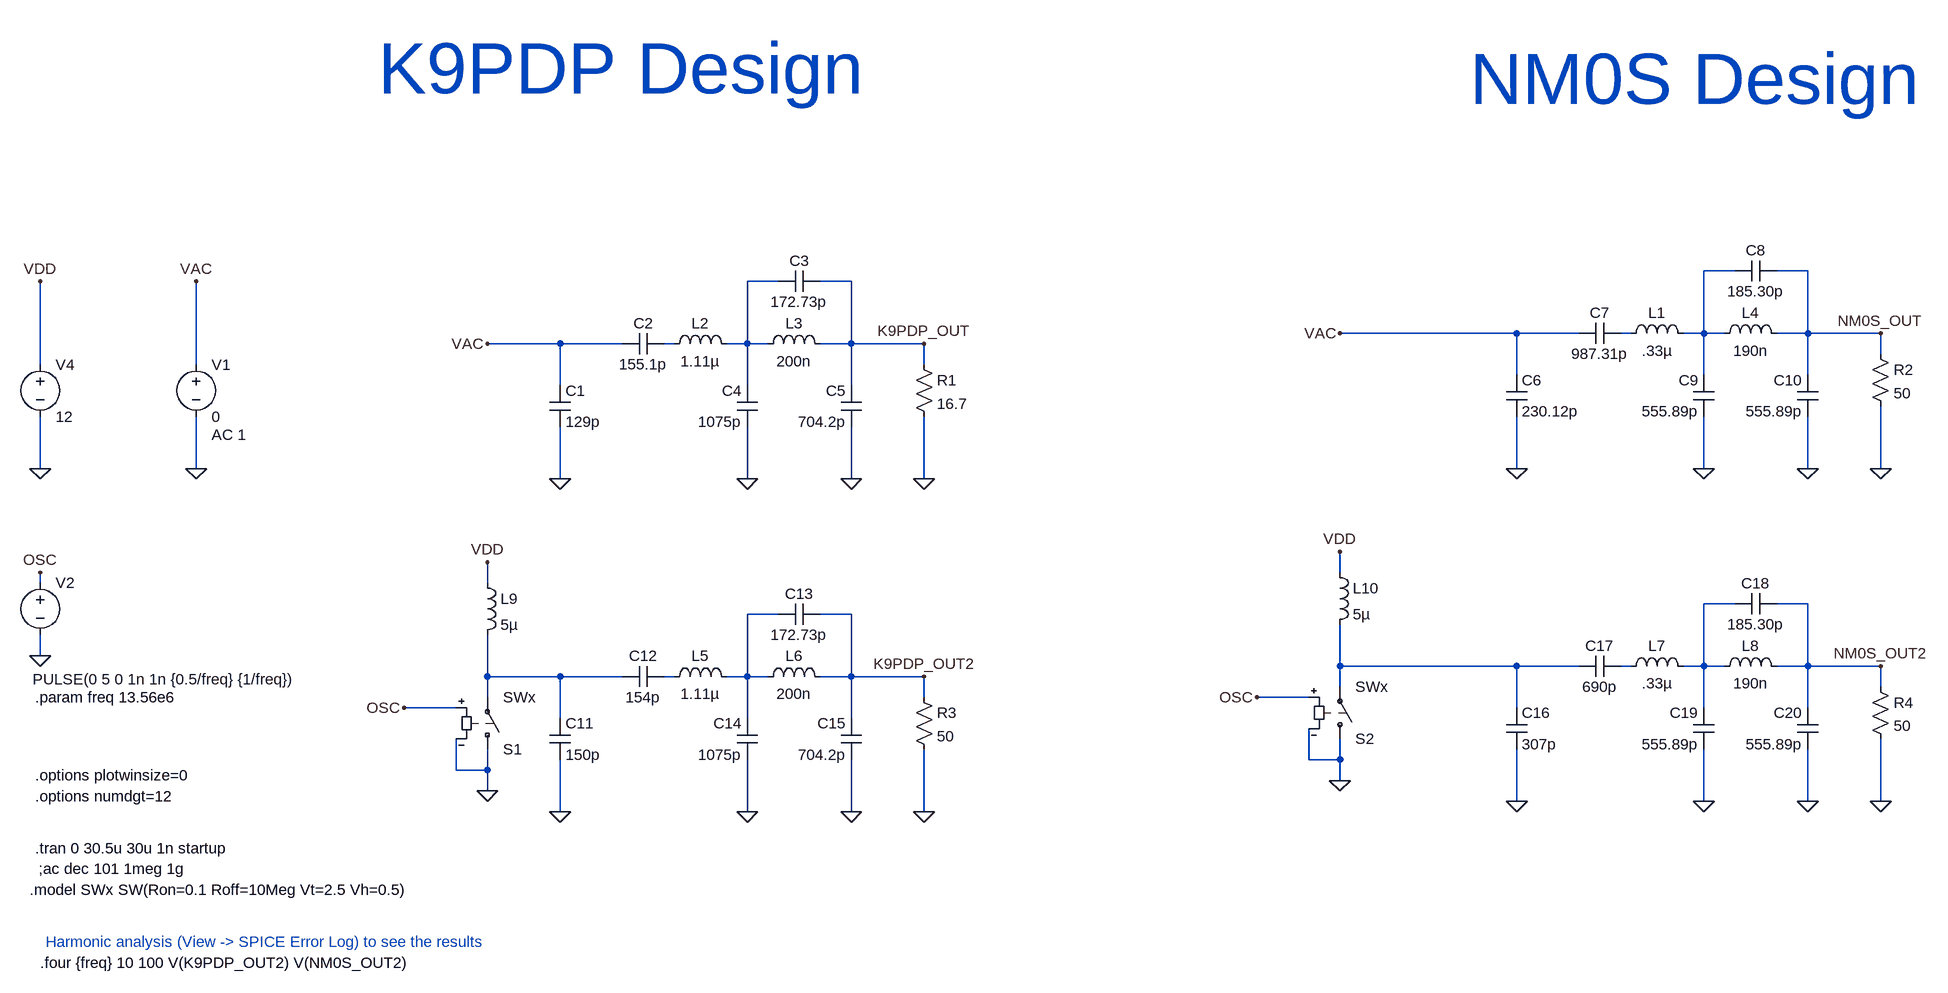
[diagram p0: schematic Class_E.asc]
Class_E.asc, the LTspice schematic file:
Version 4
SHEET 1 2136 1064
WIRE 1824 -16 1776 -16
WIRE 1936 -16 1888 -16
WIRE 352 0 304 0
WIRE 464 0 416 0
WIRE 1488 80 1216 80
WIRE 1584 80 1488 80
WIRE 1664 80 1648 80
WIRE 1776 80 1776 -16
WIRE 1776 80 1744 80
WIRE 1808 80 1776 80
WIRE 1936 80 1936 -16
WIRE 1936 80 1888 80
WIRE 2048 80 1936 80
WIRE 16 96 -96 96
WIRE 112 96 16 96
WIRE 192 96 176 96
WIRE 304 96 304 0
WIRE 304 96 272 96
WIRE 336 96 304 96
WIRE 464 96 464 0
WIRE 464 96 416 96
WIRE 576 96 464 96
WIRE 2048 112 2048 80
WIRE -784 128 -784 0
WIRE -544 128 -544 0
WIRE 576 128 576 96
WIRE 1488 144 1488 80
WIRE 1776 144 1776 80
WIRE 1936 144 1936 80
WIRE 16 160 16 96
WIRE 304 160 304 96
WIRE 464 160 464 96
WIRE -784 288 -784 208
WIRE -544 288 -544 208
WIRE 1488 288 1488 208
WIRE 1776 288 1776 208
WIRE 1936 288 1936 208
WIRE 2048 288 2048 192
WIRE 16 304 16 224
WIRE 304 304 304 224
WIRE 464 304 464 224
WIRE 576 304 576 208
WIRE 1216 448 1216 416
WIRE -784 464 -784 448
WIRE -96 464 -96 432
WIRE 1824 496 1776 496
WIRE 1936 496 1888 496
WIRE 352 512 304 512
WIRE 464 512 416 512
WIRE -784 576 -784 544
WIRE 1216 592 1216 528
WIRE 1488 592 1216 592
WIRE 1584 592 1488 592
WIRE 1664 592 1648 592
WIRE 1776 592 1776 496
WIRE 1776 592 1744 592
WIRE 1808 592 1776 592
WIRE 1936 592 1936 496
WIRE 1936 592 1888 592
WIRE 2048 592 1936 592
WIRE -96 608 -96 544
WIRE 16 608 -96 608
WIRE 112 608 16 608
WIRE 192 608 176 608
WIRE 304 608 304 512
WIRE 304 608 272 608
WIRE 336 608 304 608
WIRE 464 608 464 512
WIRE 464 608 416 608
WIRE 576 608 464 608
WIRE 1216 624 1216 592
WIRE 2048 624 2048 592
WIRE -96 640 -96 608
WIRE 576 640 576 608
WIRE 1168 640 1088 640
WIRE -144 656 -224 656
WIRE 1488 656 1488 592
WIRE 1776 656 1776 592
WIRE 1936 656 1936 592
WIRE 16 672 16 608
WIRE 304 672 304 608
WIRE 464 672 464 608
WIRE 1168 736 1168 688
WIRE 1216 736 1216 704
WIRE 1216 736 1168 736
WIRE -144 752 -144 704
WIRE -96 752 -96 720
WIRE -96 752 -144 752
WIRE 1216 768 1216 736
WIRE -96 784 -96 752
WIRE 1488 800 1488 720
WIRE 1776 800 1776 720
WIRE 1936 800 1936 720
WIRE 2048 800 2048 704
WIRE 16 816 16 736
WIRE 304 816 304 736
WIRE 464 816 464 736
WIRE 576 816 576 720
FLAG -544 288 0
FLAG 16 304 0
FLAG 304 304 0
FLAG 464 304 0
FLAG 576 304 0
FLAG 1488 288 0
FLAG 1776 288 0
FLAG 1936 288 0
FLAG 2048 288 0
FLAG 576 96 K9PDP_OUT
FLAG 2048 80 NM0S_OUT
FLAG -544 0 VAC
FLAG -96 96 VAC
FLAG 1216 80 VAC
FLAG 16 816 0
FLAG 304 816 0
FLAG 464 816 0
FLAG 576 816 0
FLAG 576 608 K9PDP_OUT2
FLAG 1488 800 0
FLAG 1776 800 0
FLAG 1936 800 0
FLAG 2048 800 0
FLAG 2048 592 NM0S_OUT2
FLAG -784 576 0
FLAG -96 784 0
FLAG 1216 768 0
FLAG -784 288 0
FLAG -784 0 VDD
FLAG -96 432 VDD
FLAG 1216 416 VDD
FLAG -784 448 OSC
FLAG -224 656 OSC
FLAG 1088 640 OSC
SYMBOL cap 0 160 R0
SYMATTR InstName C1
SYMATTR Value 129p
SYMBOL cap 176 80 R90
WINDOW 0 0 32 VBottom 2
WINDOW 3 32 32 VTop 2
SYMATTR InstName C2
SYMATTR Value 155.1p
SYMBOL cap 416 -16 R90
WINDOW 0 0 32 VBottom 2
WINDOW 3 32 32 VTop 2
SYMATTR InstName C3
SYMATTR Value 172.73p
SYMBOL cap 320 224 R180
WINDOW 0 24 56 Left 2
WINDOW 3 24 8 Left 2
SYMATTR InstName C4
SYMATTR Value 1075p
SYMBOL cap 480 224 R180
WINDOW 0 24 56 Left 2
WINDOW 3 24 8 Left 2
SYMATTR InstName C5
SYMATTR Value 704.2p
SYMBOL ind 176 112 R270
WINDOW 0 32 56 VTop 2
WINDOW 3 5 56 VBottom 2
SYMATTR InstName L2
SYMATTR Value 1.11µ
SYMBOL ind 320 112 R270
WINDOW 0 32 56 VTop 2
WINDOW 3 5 56 VBottom 2
SYMATTR InstName L3
SYMATTR Value 200n
SYMBOL res 560 112 R0
SYMATTR InstName R1
SYMATTR Value 16.7
SYMBOL voltage -544 112 R0
WINDOW 123 24 124 Left 2
WINDOW 39 0 0 Left 0
SYMATTR Value2 AC 1
SYMATTR InstName V1
SYMATTR Value 0
SYMBOL cap 1472 144 R0
SYMATTR InstName C6
SYMATTR Value 230.12p
SYMBOL cap 1648 64 R90
WINDOW 0 0 32 VBottom 2
WINDOW 3 32 32 VTop 2
SYMATTR InstName C7
SYMATTR Value 987.31p
SYMBOL cap 1888 -32 R90
WINDOW 0 0 32 VBottom 2
WINDOW 3 32 32 VTop 2
SYMATTR InstName C8
SYMATTR Value 185.30p
SYMBOL cap 1792 208 R180
WINDOW 0 24 56 Left 2
WINDOW 3 24 8 Left 2
SYMATTR InstName C9
SYMATTR Value 555.89p
SYMBOL cap 1952 208 R180
WINDOW 0 24 56 Left 2
WINDOW 3 24 8 Left 2
SYMATTR InstName C10
SYMATTR Value 555.89p
SYMBOL ind 1648 96 R270
WINDOW 0 32 56 VTop 2
WINDOW 3 5 56 VBottom 2
SYMATTR InstName L1
SYMATTR Value .33µ
SYMBOL ind 1792 96 R270
WINDOW 0 32 56 VTop 2
WINDOW 3 5 56 VBottom 2
SYMATTR InstName L4
SYMATTR Value 190n
SYMBOL res 2032 96 R0
SYMATTR InstName R2
SYMATTR Value 50
SYMBOL cap 0 672 R0
SYMATTR InstName C11
SYMATTR Value 150p
SYMBOL cap 176 592 R90
WINDOW 0 0 32 VBottom 2
WINDOW 3 32 32 VTop 2
SYMATTR InstName C12
SYMATTR Value 154p
SYMBOL cap 416 496 R90
WINDOW 0 0 32 VBottom 2
WINDOW 3 32 32 VTop 2
SYMATTR InstName C13
SYMATTR Value 172.73p
SYMBOL cap 320 736 R180
WINDOW 0 24 56 Left 2
WINDOW 3 24 8 Left 2
SYMATTR InstName C14
SYMATTR Value 1075p
SYMBOL cap 480 736 R180
WINDOW 0 24 56 Left 2
WINDOW 3 24 8 Left 2
SYMATTR InstName C15
SYMATTR Value 704.2p
SYMBOL ind 176 624 R270
WINDOW 0 32 56 VTop 2
WINDOW 3 5 56 VBottom 2
SYMATTR InstName L5
SYMATTR Value 1.11µ
SYMBOL ind 320 624 R270
WINDOW 0 32 56 VTop 2
WINDOW 3 5 56 VBottom 2
SYMATTR InstName L6
SYMATTR Value 200n
SYMBOL res 560 624 R0
SYMATTR InstName R3
SYMATTR Value 50
SYMBOL cap 1472 656 R0
SYMATTR InstName C16
SYMATTR Value 307p
SYMBOL cap 1648 576 R90
WINDOW 0 0 32 VBottom 2
WINDOW 3 32 32 VTop 2
SYMATTR InstName C17
SYMATTR Value 690p
SYMBOL cap 1888 480 R90
WINDOW 0 0 32 VBottom 2
WINDOW 3 32 32 VTop 2
SYMATTR InstName C18
SYMATTR Value 185.30p
SYMBOL cap 1792 720 R180
WINDOW 0 24 56 Left 2
WINDOW 3 24 8 Left 2
SYMATTR InstName C19
SYMATTR Value 555.89p
SYMBOL cap 1952 720 R180
WINDOW 0 24 56 Left 2
WINDOW 3 24 8 Left 2
SYMATTR InstName C20
SYMATTR Value 555.89p
SYMBOL ind 1648 608 R270
WINDOW 0 32 56 VTop 2
WINDOW 3 5 56 VBottom 2
SYMATTR InstName L7
SYMATTR Value .33µ
SYMBOL ind 1792 608 R270
WINDOW 0 32 56 VTop 2
WINDOW 3 5 56 VBottom 2
SYMATTR InstName L8
SYMATTR Value 190n
SYMBOL res 2032 608 R0
SYMATTR InstName R4
SYMATTR Value 50
SYMBOL ind -112 448 R0
SYMATTR InstName L9
SYMATTR Value 5µ
SYMBOL ind 1200 432 R0
SYMATTR InstName L10
SYMATTR Value 5µ
SYMBOL voltage -784 448 R0
WINDOW 123 0 0 Left 0
WINDOW 39 0 0 Left 0
WINDOW 3 -12 164 Left 2
SYMATTR Value PULSE(0 5 0 1n 1n {0.5/freq} {1/freq})
SYMATTR InstName V2
SYMBOL sw -96 736 M180
SYMATTR InstName S1
SYMATTR Value SWx
SYMBOL sw 1216 720 M180
SYMATTR InstName S2
SYMATTR Value SWx
SYMBOL voltage -784 112 R0
WINDOW 123 0 0 Left 0
WINDOW 39 0 0 Left 0
SYMATTR InstName V4
SYMATTR Value 12
TEXT -560 904 Right 2 !;ac dec 101 1meg 1g
TEXT -264 -328 Left 7 ;K9PDP Design
TEXT 1416 -312 Left 7 ;NM0S Design
TEXT -800 936 Left 2 !.model SWx SW(Ron=0.1 Roff=10Meg Vt=2.5 Vh=0.5)
TEXT -792 872 Left 2 !.tran 0 30.5u 30u 1n startup
TEXT -792 640 Left 2 !.param freq 13.56e6
TEXT -792 792 Left 2 !.options numdgt=12
TEXT -792 760 Left 2 !.options plotwinsize=0
TEXT -784 1048 Left 2 !.four {freq} 10 100 V(K9PDP_OUT2) V(NM0S_OUT2)
TEXT -776 1016 Left 2 ;Harmonic analysis (View -> SPICE Error Log) to see the results

The netlist it stands for:
* Class_E.asc
C1 VAC 0 129p
C2 N004 VAC 155.1p
C3 K9PDP_OUT N002 172.73p
C4 0 N002 1075p
C5 0 K9PDP_OUT 704.2p
L2 N004 N002 1.11µ
L3 N002 K9PDP_OUT 200n
R1 K9PDP_OUT 0 16.7
V1 VAC 0 0 AC 1
C6 VAC 0 230.12p
C7 N003 VAC 987.31p
C8 NM0S_OUT N001 185.30p
C9 0 N001 555.89p
C10 0 NM0S_OUT 555.89p
L1 N003 N001 .33µ
L4 N001 NM0S_OUT 190n
R2 NM0S_OUT 0 50
C11 N009 0 150p
C12 N010 N009 154p
C13 K9PDP_OUT2 N006 172.73p
C14 0 N006 1075p
C15 0 K9PDP_OUT2 704.2p
L5 N010 N006 1.11µ
L6 N006 K9PDP_OUT2 200n
R3 K9PDP_OUT2 0 50
C16 N007 0 307p
C17 N008 N007 690p
C18 NM0S_OUT2 N005 185.30p
C19 0 N005 555.89p
C20 0 NM0S_OUT2 555.89p
L7 N008 N005 .33µ
L8 N005 NM0S_OUT2 190n
R4 NM0S_OUT2 0 50
L9 VDD N009 5µ
L10 VDD N007 5µ
V2 OSC 0 PULSE(0 5 0 1n 1n {0.5/freq} {1/freq})
S1 0 N009 OSC 0 SWx
S2 0 N007 OSC 0 SWx
V4 VDD 0 12
;ac dec 101 1meg 1g
* K9PDP Design
* NM0S Design
.model SWx SW(Ron=0.1 Roff=10Meg Vt=2.5 Vh=0.5)
.tran 0 30.5u 30u 1n startup
.param freq 13.56e6
.options numdgt=12
.options plotwinsize=0
.four {freq} 10 100 V(K9PDP_OUT2) V(NM0S_OUT2)
* Harmonic analysis (View -> SPICE Error Log) to see the results
.backanno
.end